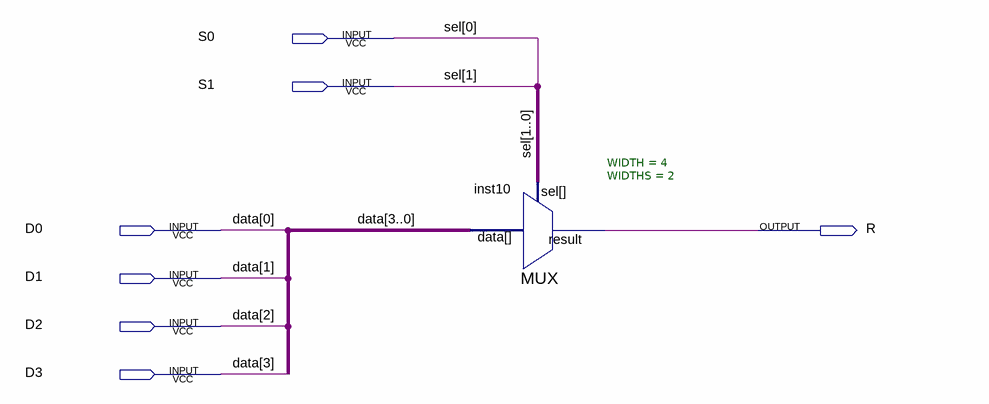
[diagram p0: schematic sheet]
// Quartus schematic mux4to2.bdf as structural Verilog: 1 symbols, 7 pins
module mux4to2 (
  input  S0,
  input  S1,
  input  D0,
  input  D1,
  input  D2,
  input  D3,
  output R
);

  MUX #(.WIDTH(4), .WIDTHS(2)) inst10 (.data({D3, D2, D1, D0}), .sel({S1, S0}), .result(R));

  // Other names for the same wires on the sheet: data[3:0] = {D3, D2, D1, D0}; sel[1:0] = {S1, S0}
endmodule
